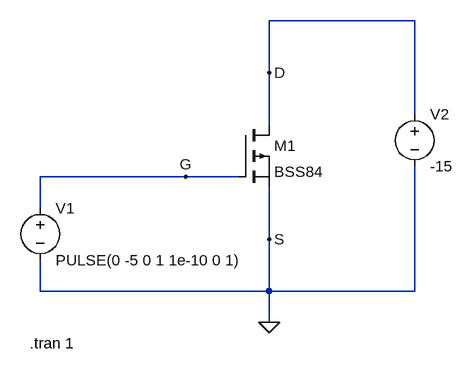
[diagram p0: schematic bss84.asc]
bss84.asc, the LTspice schematic file:
Version 4.1
SHEET 1 880 680
WIRE 448 -32 224 -32
WIRE 224 48 224 -32
WIRE 448 112 448 -32
WIRE 224 128 224 48
WIRE 96 208 -128 208
WIRE 176 208 96 208
WIRE -128 256 -128 208
WIRE 224 304 224 224
WIRE -128 384 -128 336
WIRE 224 384 224 304
WIRE 224 384 -128 384
WIRE 448 384 448 192
WIRE 448 384 224 384
WIRE 224 432 224 384
FLAG 224 432 0
FLAG 96 208 G
FLAG 224 304 S
FLAG 224 48 D
SYMBOL pmos 176 128 R0
SYMATTR InstName M1
SYMATTR Value BSS84
SYMBOL voltage -128 240 R0
WINDOW 123 0 0 Left 0
WINDOW 39 0 0 Left 0
SYMATTR InstName V1
SYMATTR Value PULSE(0 -5 0 1 1e-10 0 1)
SYMBOL voltage 448 96 R0
WINDOW 123 0 0 Left 0
WINDOW 39 0 0 Left 0
SYMATTR InstName V2
SYMATTR Value -15
TEXT -144 464 Left 2 !.tran 1

The netlist it stands for:
* bss84.asc
M1 D G 0 0 BSS84
V1 G 0 PULSE(0 -5 0 1 1e-10 0 1)
V2 D 0 -15
.model NMOS NMOS
.model PMOS PMOS
.lib standard.mos
.tran 1
.backanno
.end